# Altium schematic sheet host.SchDoc
size A4; SheetNumber: 4; SheetTotal: 5
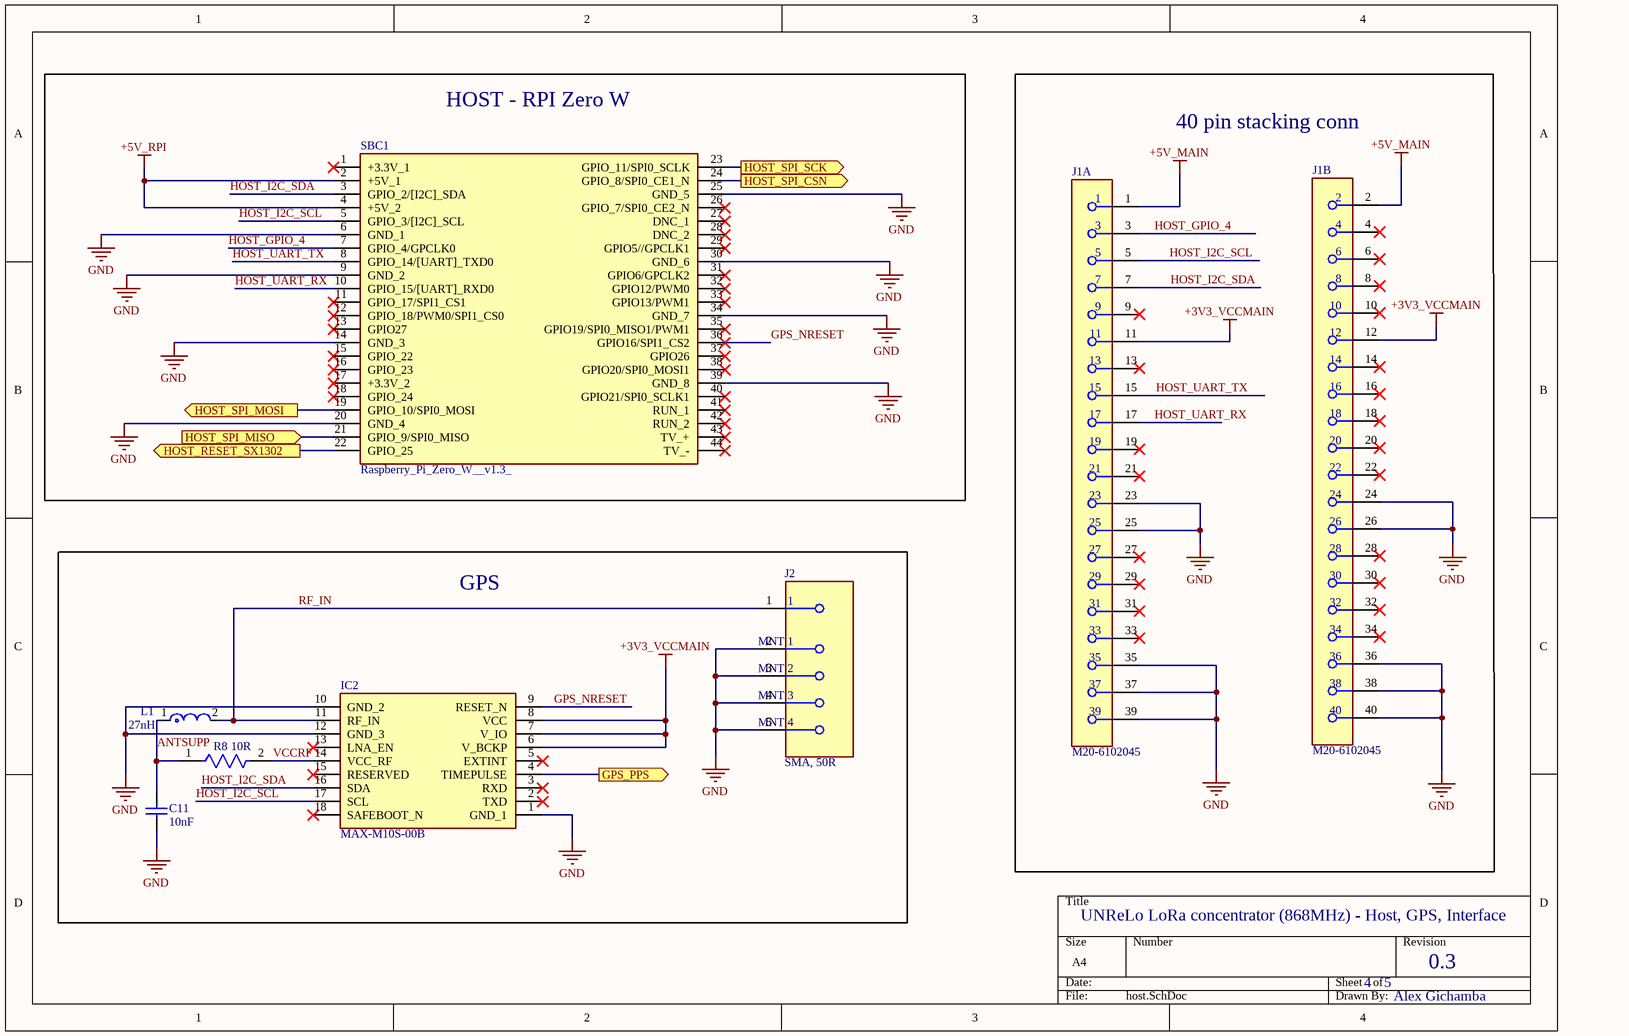
[diagram p0: host.SchDoc]

## Parts
C11  10nF  [CAPC1608X90X35NL15T15]
IC2  MAX-M10S-00B  [MAXM10S00B]
J1  M20-6102045  [FP-M20-6102045-MFG]  (parts A,B of 2)
J2  SMA, 50R  [FP-SMA-J-P-H-ST-EM1-MFG]
L1  27nH  [FP-LQG15HH_02-IPC_C]
R8  10R  [FP-ERJ3EK-MFG]
SBC1  Raspberry_Pi_Zero_W__v1.3_  [RASPBERRYPIZEROWV13]

## Blocks framed on the sheet
HOST - RPI Zero W: SBC1
40 pin stacking conn: J1
GPS: C11 IC2 J2 L1 R8

## Ports
GPS_PPS (out), HOST_RESET_SX1302 (out), HOST_SPI_CSN (out), HOST_SPI_MISO (in), HOST_SPI_MOSI (out), HOST_SPI_SCK (out)

## Nets
+3V3_VCCMAIN: IC2.6(V_BCKP) IC2.7(V_IO) IC2.8(VCC) J1.11 J1.12
+5V_MAIN: J1.1 J1.2
+5V_RPI: SBC1.2(+5V_1) SBC1.4(+5V_2)
GND: C11.1 IC2.1(GND_1) IC2.10(GND_2) IC2.12(GND_3) J1.23 J1.24 J1.25 J1.26 J1.35 J1.36 J1.37 J1.38 J1.39 J1.40 J2.2(MNT_1) J2.3(MNT_2) J2.4(MNT_3) J2.5(MNT_4) SBC1.6(GND_1) SBC1.9(GND_2) SBC1.14(GND_3) SBC1.20(GND_4) SBC1.25(GND_5) SBC1.30(GND_6) SBC1.34(GND_7) SBC1.39(GND_8)
ANTSUPP: C11.2 L1.1 R8.1
GPS_NRESET: IC2.9(RESET_N) SBC1.36(GPIO16/SPI1_CS2)
GPS_PPS: IC2.4(TIMEPULSE) ; port GPS_PPS
HOST_GPIO_4: J1.3 SBC1.7(GPIO_4/GPCLK0)
HOST_I2C_SCL: IC2.17(SCL) J1.5 SBC1.5(GPIO_3/[I2C]_SCL)
HOST_I2C_SDA: IC2.16(SDA) J1.7 SBC1.3(GPIO_2/[I2C]_SDA)
HOST_RESET_SX1302: SBC1.22(GPIO_25) ; port HOST_RESET_SX1302
HOST_SPI_CSN: SBC1.24(GPIO_8/SPI0_CE1_N) ; port HOST_SPI_CSN
HOST_SPI_MISO: SBC1.21(GPIO_9/SPI0_MISO) ; port HOST_SPI_MISO
HOST_SPI_MOSI: SBC1.19(GPIO_10/SPI0_MOSI) ; port HOST_SPI_MOSI
HOST_SPI_SCK: SBC1.23(GPIO_11/SPI0_SCLK) ; port HOST_SPI_SCK
HOST_UART_RX: J1.17 SBC1.10(GPIO_15/[UART]_RXD0)
HOST_UART_TX: J1.15 SBC1.8(GPIO_14/[UART]_TXD0)
RF_IN: IC2.11(RF_IN) J2.1 L1.2
VCCRF: IC2.14(VCC_RF) R8.2

Not connected (* = marked no-connect by the designer): IC2 2(TXD)* 3(RXD)* 5(EXTINT)* 13(LNA_EN)* 15(RESERVED)* 18(SAFEBOOT_N)*; J1 4* 6* 8* 9* 10* 13* 14* 16* 18* 19* 20* 21* 22* 27* 28* 29* 30* 31* 32* 33* 34*; SBC1 1(+3.3V_1)* 11(GPIO_17/SPI1_CS1)* 12(GPIO_18/PWM0/SPI1_CS0)* 13(GPIO27)* 15(GPIO_22)* 16(GPIO_23)* 17(+3.3V_2)* 18(GPIO_24)* 26(GPIO_7/SPI0_CE2_N)* 27(DNC_1)* 28(DNC_2)* 29(GPIO5//GPCLK1)* 31(GPIO6/GPCLK2)* 32(GPIO12/PWM0)* 33(GPIO13/PWM1)* 35(GPIO19/SPI0_MISO1/PWM1)* 37(GPIO26)* 38(GPIO20/SPI0_MOSI1)* 40(GPIO21/SPI0_SCLK1)* 41(RUN_1)* 42(RUN_2)* 43(TV_+)* 44(TV_-)*

## Notes on the sheet
- UNReLo LoRa concentrator (868MHz) - Host, GPS, Interface
- 4
- 5
- 0.3
- Alex Gichamba

## Library data of the parts
C11 = CMP-2006-02084-1: Manufacturer: AVX Interconnect / Elco; Part Number: 0603YC103JAT2A
IC2 = MAX-M10S-00B: Integrated Circuit; Manufacturer_Name: U-Blox; Datasheet Link: https://content.u-blox.com/sites/default/files/MAX-M10S_IntegrationManual_UBX-20053088.pdf; Height: 2.7mm; Manufacturer_Part_Number: MAX-M10S-00B; Mouser Part Number: 377-MAX-M10S-00B; Mouser Price/Stock: https://www.mouser.co.uk/ProductDetail/u-blox/MAX-M10S-00B?qs=A6eO%252BMLsxmT0PfQYPb7LLQ%3D%3D
J1 = CMP-15831-000080-1: CONN STKTHRU PC/104 40POS PCB; Current Rating: 3A; Pitch: 2.54mm; Insulation Resistance: 5GR; Contact Resistance: 30mR; Number of Positions: 40; Gender: Receptacle; REACH SVHC: No SVHC; Housing Material: Nylon; Number of Rows: 2; Min Operating Temperature: -55°C; Contact Plating: Gold; Orientation: Straight; Mount: Through Hole; Contact Material: Bronze; Length: 51.46mm; Weight: 0.218205oz; Number of Contacts: 40; Packaging: Rail/Tube; Depth: 5.25mm; Termination: Solder; Radiation Hardening: No; Flammability Rating: UL94 V-0; Housing Color: Black; Max Operating Temperature: 105°C; Material: Nylon; Package Quantity: 11; Color: Black; Max Current Rating: 3A; Series: M20
J2 = CMP-02754-000006-1: CONN SMA JACK STR 50OHM EDGE MNT; Dielectric Material: PTFE; Center Contact Plating: Gold; Max Frequency: 6GHz; Body Material: Brass; Voltage Rating: 335V; Package Quantity: 1; Case/Package: SMA; Max Operating Temperature: 125°C; Fastening Type: Threaded; Orientation: Straight; Depth: 13.33mm; RoHS Compliant: Yes; Length: 6.35mm; Insulation Material: Polytetrafluoroethylene; Termination: Solder; Min Operating Temperature: -65°C; Housing Color: Gold; Impedance: 50R; Contact Plating: Gold; Contact Material: Copper; Connector Type: SMA; Mount: Edge; Series: SMA; Packaging: Tray; Body Plating: Gold; Radiation Hardening: No
L1 = CMP-2000-06578-2: Multilayer type RF Inductor 27nH ±5% 0.46Ω 350mA 0402; DC Current: 300mA; Core Material: Air; Self Resonant Frequency: 1.7GHz; Q Factor: 8; DC Resistance (DCR): 460mR; Shielding: Unshielded; Test Frequency: 100MHz; Inductance: 27nH; Width: 0.02inch; Length: 1mm; Height - Seated (Max): 0.022inch; Military Standard: Not; Case Code (Imperial): 0402; Tolerance: 5%; Depth: 0.55mm; Current Rating: 300mA; Inductance Tolerance: 5%; Lead Free: Lead Free; Height: 0.5mm; Max DC Current: 300mA; REACH SVHC: No SVHC; Package Quantity: 10000; Mount: Surface Mount; Termination: SMD/SMT; Case Code (Metric): 1005; Case/Package: 0402; Max Operating Temperature: 125°C; Packaging: Tape and Reel; Min Operating Temperature: -55°C
R8 = CMP-2000-00195-2: RES SMD 10 OHM 1% 1/10W 0603; Manufacturer Part Number: ERJ-3EKF10R0V; Manufacturer: Panasonic; Resistance: 10Ω; Voltage Rating: 75V; Value: 10Ω; Power: 100mW; Power Rating: 0.1W; Temperature Coefficient: 100ppm/°C; Automotive Grade: Grade 0; Lead Free: Yes; Device Class L1: Passive Components; Digikey Description: RES SMD 10 OHM 1% 1/10W 0603; Octopart: https://octopart.com/erj-3ekf10r0v-panasonic-55403649; Automotive: Yes; ComponentLink2URL: https://b2b-api.panasonic.eu/file_stream/pids/fileversion/1263; Height: 0.55mm; Temperature Range High: +155°C; Footprint Url: https://industrial.panasonic.com/cdbs/www-data/pdf/RDA0000/DMA0000COL17.pdf; Temperature: -55°C to +155°C; Tolerance: 1%; ComponentLink2Description: Datasheet; Package: ERJ3EK; Device Class L2: Resistors; Category: Res; Ipc Land Pattern Name: RESC16080X45; RoHS: TRUE; Composition: Thick Film; Device Class L3: Chip SMD Resistors; Temperature Range Low: -55°C; Series: ERJ
SBC1 = Raspberry_Pi_Zero_W__v1.3_: Integrated Circuit; Manufacturer_Name: RASPBERRY-PI; Manufacturer_Part_Number: Raspberry Pi Zero W (v1.3); Datasheet Link: https://cdn.sparkfun.com/assets/learn_tutorials/6/7/6/PiZero_1.pdf